# Altium project 光纤切割机电装图_E150_V2.PRJPCB
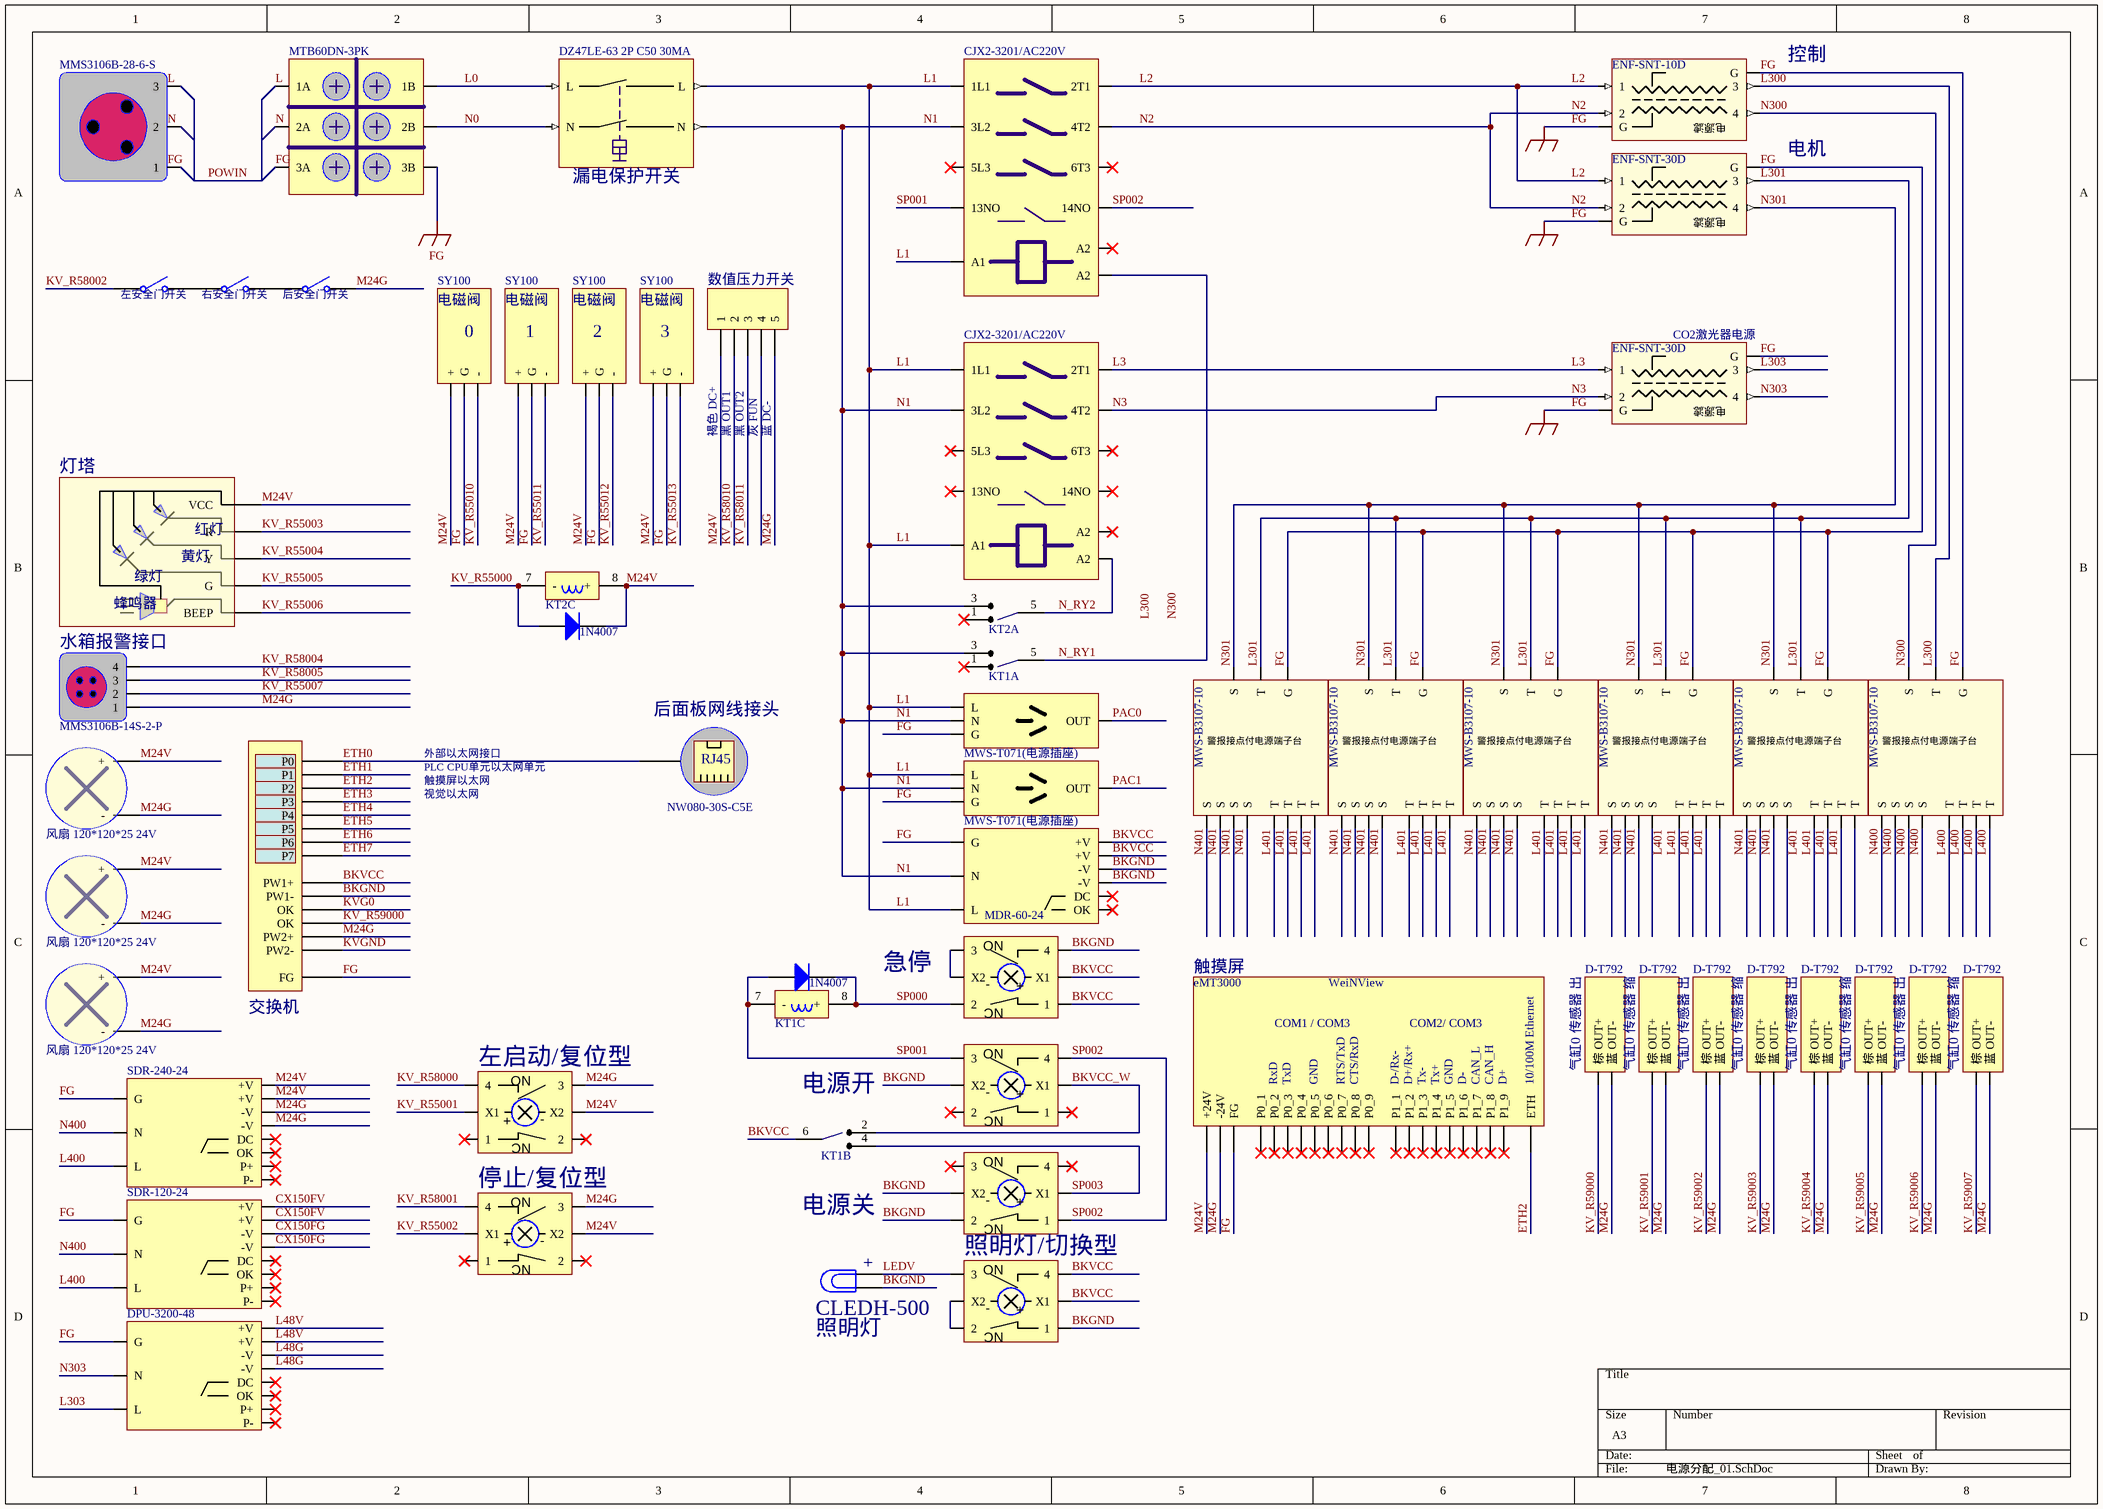
[diagram p0: 电源分配_01.SchDoc]
9 sheets, 125 parts. Net scope: global (net labels, ports and power ports of the same name join across sheets).
Sheets:
  电源分配_01.SchDoc
  KV7500_PLC.SchDoc
  KV2_MotionA12.SchDoc
  KV_Vision.SchDoc
  E150_Laser.SchDoc
  KV2_MotionA9A.SchDoc
  KV2_MotionA34.SchDoc
  KV2_MotionA56.SchDoc
  KV2_MotionA78.SchDoc

## Sheet 电源分配_01.SchDoc
size A3; PageSetup: Record=PageOptions|CenterHorizontal=True|CenterVertical=True|PrintScale=1.00|XCorrection=1.00|YCorrection=1.00|PrintKind=2|BorderSize=5000000|LeftOffset=0|BottomOffset=0|Orientation=2|PaperLength=1000|PaperWidth=1000|Scale=100|PaperSource=7|PrintQuality=-4|MediaType=1|DitherType=10|PaperKind=A3|PrintScaleMode=1

### Parts
(Parts that share a designator on the sheet are numbered #1, #2 ... from top to bottom, then left to right.)
*#1  DZ47LE-63 2P C50 30MA
*#2  ENF-SNT-10D
*#3  MMS3106B-28-6-S
*#4  MTB60DN-3PK
*#5  CJX2-3201/AC220V
*#6  ENF-SNT-30D
*#7  SY100
*#8  SY100
*#9  SY100
*#10  SY100
*#11  ENF-SNT-30D
*#12  CJX2-3201/AC220V
*#13  灯塔  (value not drawn)
*#14  MMS3106B-14S-2-P
*#15  MWS-T071(电源插座)
*#16  MWS-B3107-10
*#17  MWS-B3107-10
*#18  MWS-B3107-10
*#19  MWS-B3107-10
*#20  MWS-B3107-10
*#21  MWS-B3107-10
*#22  NW080-30S-C5E
*#23  风扇 120*120*25 24V
*#24  MWS-T071(电源插座)
*#25  SWITCH  (value not drawn)
*#26  MDR-60-24
*#27  风扇 120*120*25 24V
*#28  YMP22C-LMC2  (value not drawn)
*#29  风扇 120*120*25 24V
*#30  D-T792
*#31  D-T792
*#32  D-T792
*#33  D-T792
*#34  D-T792
*#35  D-T792
*#36  D-T792
*#37  D-T792
*#38  eMT3000
*#39  YMP22C-LMC2  (value not drawn)
*#40  YMP22C-LMC2  (value not drawn)
*#41  SDR-240-24
*#42  YMP22C-LMC2  (value not drawn)
*#43  YMP22C-LMC2  (value not drawn)
*#44  SDR-120-24
*#45  YMP22C-LMC2  (value not drawn)
*#46  DPU-3200-48
D?#1  1N4007  [DO-41]
D?#2  1N4007  [DO-41]
DS?  Lamp  [PIN2]  (value not drawn)
KT1  LY2N-J  (value not drawn)  (parts A,B,C of 3)
KT2  LY2N-J  (value not drawn)  (parts A,C of 3)
P?#1  Header 5  [HDR1X5]  (value not drawn)
S?#1  SW-SPST  [SPST-2]  (value not drawn)
S?#2  SW-SPST  [SPST-2]  (value not drawn)
S?#3  SW-SPST  [SPST-2]  (value not drawn)

### Nets
FG: *#2.1(G) *#4.2(3A) *#6.1(G) *#7.1(G) *#8.1(G) *#9.1(G) *#10.1(G) *#11.1(G) *#15.0(G) *#16.2(G) *#17.2(G) *#18.2(G) *#19.2(G) *#20.2(G) *#21.2(G) *#24.0(G) *#25.0(FG) *#26.6(G) *#38.174(FG) *#41.6(G) *#44.6(G) *#46.6(G)
L48G: *#46.2(-V) *#46.3(-V)
BKGND: *#25.0(PW1-) *#26.2(-V) *#26.3(-V) *#28.3(4) *#39.5(X2) *#42.1(2) *#42.5(X2) *#45.0(1) DS?.1
BKVCC: *#25.0(PW1+) *#26.0(+V) *#26.1(+V) *#28.0(1) *#28.4(X1) *#45.3(4) *#45.4(X1) KT1.6
BKVCC_W: *#39.4(X1) KT1.2
CX150FG: *#44.2(-V) *#44.3(-V)
CX150FV: *#44.0(+V) *#44.1(+V)
ETH0: *#22.0 *#25.3(P0)
ETH1: *#25.4(P1)
ETH2: *#25.5(P2) *#38.193(ETH)
ETH3: *#25.6(P3)
ETH4: *#25.3(P4)
ETH5: *#25.4(P5)
ETH6: *#25.5(P6)
ETH7: *#25.6(P7)
KV_R55000: D?#1.1(A) KT2.7(-)
KV_R55001: *#40.4(X1)
KV_R55002: *#43.4(X1)
KV_R55003: *#13.0(R)
KV_R55004: *#13.0(Y)
KV_R55005: *#13.0(G)
KV_R55006: *#13.0(BEEP)
KV_R55007: *#14.1(2)
KV_R55010: *#7.2(-)
KV_R55011: *#8.2(-)
KV_R55012: *#9.2(-)
KV_R55013: *#10.2(-)
KV_R58000: *#40.3(4)
KV_R58001: *#43.3(4)
KV_R58002: S?#1.1(COMMON)
KV_R58004: *#14.3(4)
KV_R58005: *#14.2(3)
KV_R58010: P?#1.2
KV_R58011: P?#1.3
KV_R59000: *#25.2(OK) *#30.1(棕_OUT+)
KV_R59001: *#31.1(棕_OUT+)
KV_R59002: *#32.1(棕_OUT+)
KV_R59003: *#33.1(棕_OUT+)
KV_R59004: *#34.1(棕_OUT+)
KV_R59005: *#35.1(棕_OUT+)
KV_R59006: *#36.1(棕_OUT+)
KV_R59007: *#37.1(棕_OUT+)
KVG0: *#25.1(OK)
KVGND: *#25.0(PW2-)
L: *#4.0(1A)
L0: *#1.1(L) *#4.0(1B)
L1: *#1.3(L) *#5.1L1 *#12.1L1 *#15.2(L) *#24.2(L) *#26.8(L)
L2: *#2.1 *#5.3(2T1) *#6.1
L3: *#11.1 *#12.3(13NO)
L48V: *#46.0(+V) *#46.1(+V)
L300: *#2.3 *#21.1(T)
L301: *#6.3 *#16.1(T) *#17.1(T) *#18.1(T) *#19.1(T) *#20.1(T)
L303: *#11.3 *#46.8(L)
L400: *#21.1(T) *#41.8(L) *#44.8(L)
L401: *#16.1(T) *#17.1(T) *#18.1(T) *#19.1(T) *#20.1(T)
LEDV: *#45.2(3) DS?.2
M24G: *#14.0(1) *#23.19(-) *#25.0(PW2+) *#27.19(-) *#29.19(-) *#30.2(蓝_OUT-) *#31.2(蓝_OUT-) *#32.2(蓝_OUT-) *#33.2(蓝_OUT-) *#34.2(蓝_OUT-) *#35.2(蓝_OUT-) *#36.2(蓝_OUT-) *#37.2(蓝_OUT-) *#38.173(-24V) *#40.2(3) *#41.2(-V) *#41.3(-V) *#43.2(3) P?#1.5 S?#3.2(NO)
M24V: *#7.0(+) *#8.0(+) *#9.0(+) *#10.0(+) *#13.1(VCC) *#23.20(+) *#27.20(+) *#29.20(+) *#38.172(+24V) *#40.5(X2) *#41.0(+V) *#41.1(+V) *#43.5(X2) D?#1.2(K) KT2.8(+) P?#1.1
N: *#4.1(2A)
N0: *#1.0(N) *#4.1(2B)
N1: *#1.2(N) *#5.3L2 *#12.3L2 *#15.1(N) *#24.1(N) *#26.7(N) KT1.3 KT2.3
N2: *#2.2 *#5.5L3 *#6.2
N3: *#11.2 *#12.5L3
N300: *#2.4 *#21.0(S)
N301: *#6.4 *#16.0(S) *#17.0(S) *#18.0(S) *#19.0(S) *#20.0(S)
N303: *#11.4 *#46.7(N)
N400: *#21.0(S) *#41.7(N) *#44.7(N)
N401: *#16.0(S) *#17.0(S) *#18.0(S) *#19.0(S) *#20.0(S)
N_RY1: *#5.1L1(A2) KT1.5
N_RY2: *#12.1L1(A2) KT2.5
PAC0: *#15.1(OUT)
PAC1: *#24.1(OUT)
SP000: *#28.1(2) D?#2.2(K) KT1.8(+)
SP001: *#5.3(13NO) *#39.2(3) D?#2.1(A) KT1.7(-)
SP002: *#5.1L1(14NO) *#39.3(4) *#42.0(1)
SP003: *#42.4(X1) KT1.4
Net*#28_2: *#28.2(3) *#28.5(X2)
Net*#45_1: *#45.1(2) *#45.5(X2)
NetS?#1_2: S?#1.2(NO) S?#2.1(COMMON)
NetS?#2_2: S?#2.2(NO) S?#3.1(COMMON)

Not connected (* = marked no-connect by the designer): *#3 0(1) 1(2) 2(3); *#26 4(DC)* 5(OK)*; *#38 175(P0_1)* 176(P0_2)* 177(P0_3)* 178(P0_4)* 179(P0_5)* 180(P0_6)* 181(P0_7)* 182(P0_8)* 183(P0_9)* 184(P1_1)* 185(P1_2)* 186(P1_3)* 187(P1_4)* 188(P1_5)* 189(P1_6)* 190(P1_7)* 191(P1_8)* 192(P1_9)*; *#39 0(1)* 1(2)*; *#40 0(1)* 1(2)*; *#41 4(DC)* 5(OK)*; *#42 2(3)* 3(4)*; *#43 0(1)* 1(2)*; *#44 4(DC)* 5(OK)*; *#46 4(DC)* 5(OK)*; KT1 1*; KT2 1*; P?#1 4

### Buses and harness runs
bus POWIN

### Notes on the sheet
- (near *#2) 控制
- (near *#1) 漏电保护开关
- (near *#6) 电机
- (near S?#1) 左安全门开关
- (near S?#2) 右安全门开关
- (near S?#3) 后安全门开关
- 电磁阀
- (near P?#1) 数值压力开关
- (near *#7) 0
- (near *#8) 1
- (near *#9) 2
- 3
- (near *#11) CO2激光器电源
- (near *#10) 褐色 DC+
- (near *#10) 黑 OUT1
- 黑 OUT2
- 灰 FUN
- 蓝 DC-
- 灯塔
- (near *#14) 水箱报警接口
- (near *#22) 后面板网线接头
- 外部以太网接口
- PLC CPU单元以太网单元
- 触摸屏以太网
- 视觉以太网
- 急停
- 触摸屏
- (near *#25) 交换机
- (near *#40) 左启动/复位型
- (near KT1) 电源开
- (near *#30) 气缸0 传感器 出
- (near *#30) 气缸0 传感器 缩
- (near *#31) 气缸0 传感器 出
- (near *#32) 气缸0 传感器 缩
- (near *#33) 气缸0 传感器 出
- (near *#34) 气缸0 传感器 缩
- (near *#35) 气缸0 传感器 出
- (near *#36) 气缸0 传感器 缩
- (near *#43) 停止/复位型
- 电源关
- (near *#42) 照明灯/切换型
- (near DS?) CLEDH-500
- (near DS?) +
- (near DS?) 照明灯
- Labels drawn without touching a wire or pin: FG, L, L300, L401, N, N300
- (in symbol eMT3000) WeiNView; COM1 / COM3; COM2/ COM3; RxD; TxD; GND; RTS/TxD; CTS/RxD; D-/Rx-; D+/Rx+; Tx-; Tx+; D-; CAN_L; CAN_H; D+; 10/100M Ethernet
- (in symbol ENF-SN) 电源滤
- (in symbol MWS-B3107-10) 警报接点付电源端子台
- (in symbol NW080-30S-C5E) RJ45
- (in symbol YMP22C) NO; -; +; NC
- (in symbol 灯塔) 红灯; 黄灯; 绿灯; 蜂鸣器

### Library data of the parts
*#1 = 空气开关(单相)
*#2 *#6 *#11 = ENF-SN
*#3 = MMS3106B-2
*#4 = MTB60D
*#5 *#12 = CJX2-3201/A
*#14 = EMSH-RST-C9-CA-5
*#23 *#27 *#29 = FAN
*#26 = MDR-60
*#28 *#39 *#40 *#42 *#43 *#45 = YMP22C
*#41 *#44 *#46 = SDR-480P
D?#1 D?#2 = Diode 1N4007: 1 Amp General Purpose Rectifier; Published: 8-Jun-2000; LatestRevisionDate: 17-Jul-2002; LatestRevisionNote: Re-released for DXP Platform.; DatasheetVersion: 1998; PackageVersion: Aug-1999; PackageReference: DO-41; Publisher: Altium Limited; PackageDescription: Diode, Axial; Body 5.2 x 2.7 mm (LxDia. max), Lead Dia. 0.86 mm (max); Code_JEDEC: DO-204-AL; ComponentLink1Description: Manufacturer Link; ComponentLink1URL: http://www.fairchildsemi.com/; ComponentLink2Description: Datasheet; ComponentLink2URL: http://www.fairchildsemi.com/ds/1N%2F1N4001.pdf
DS? = Lamp: Incandescent Bulb; Published: 24-Mar-1999; LatestRevisionDate: 17-Jul-2002; LatestRevisionNote: Re-released for DXP Platform.; PackageReference: PIN2; Publisher: Altium Limited
KT1 KT2 = L
P?#1 = Header 5: Header, 5-Pin; LatestRevisionDate: 17-Jul-2002; LatestRevisionNote: Re-released for DXP Platform.; Publisher: Altium Limited
S?#1-S?#3 = SW-SPST: Single-Pole, Single-Throw Switch; Published: 24-Mar-1999; LatestRevisionDate: 17-Jul-2002; LatestRevisionNote: Re-released for DXP Platform.; PackageReference: SPST-2; Publisher: Altium Limited

## Sheet KV7500_PLC.SchDoc
size A3; PageSetup: Record=PageOptions|CenterHorizontal=True|CenterVertical=True|PrintScale=1.00|XCorrection=1.00|YCorrection=1.00|PrintKind=2|BorderSize=5000000|LeftOffset=0|BottomOffset=0|Orientation=2|PaperLength=1000|PaperWidth=1000|Scale=100|PaperSource=7|PrintQuality=-4|MediaType=1|DitherType=10|PaperKind=A3|PrintScaleMode=1
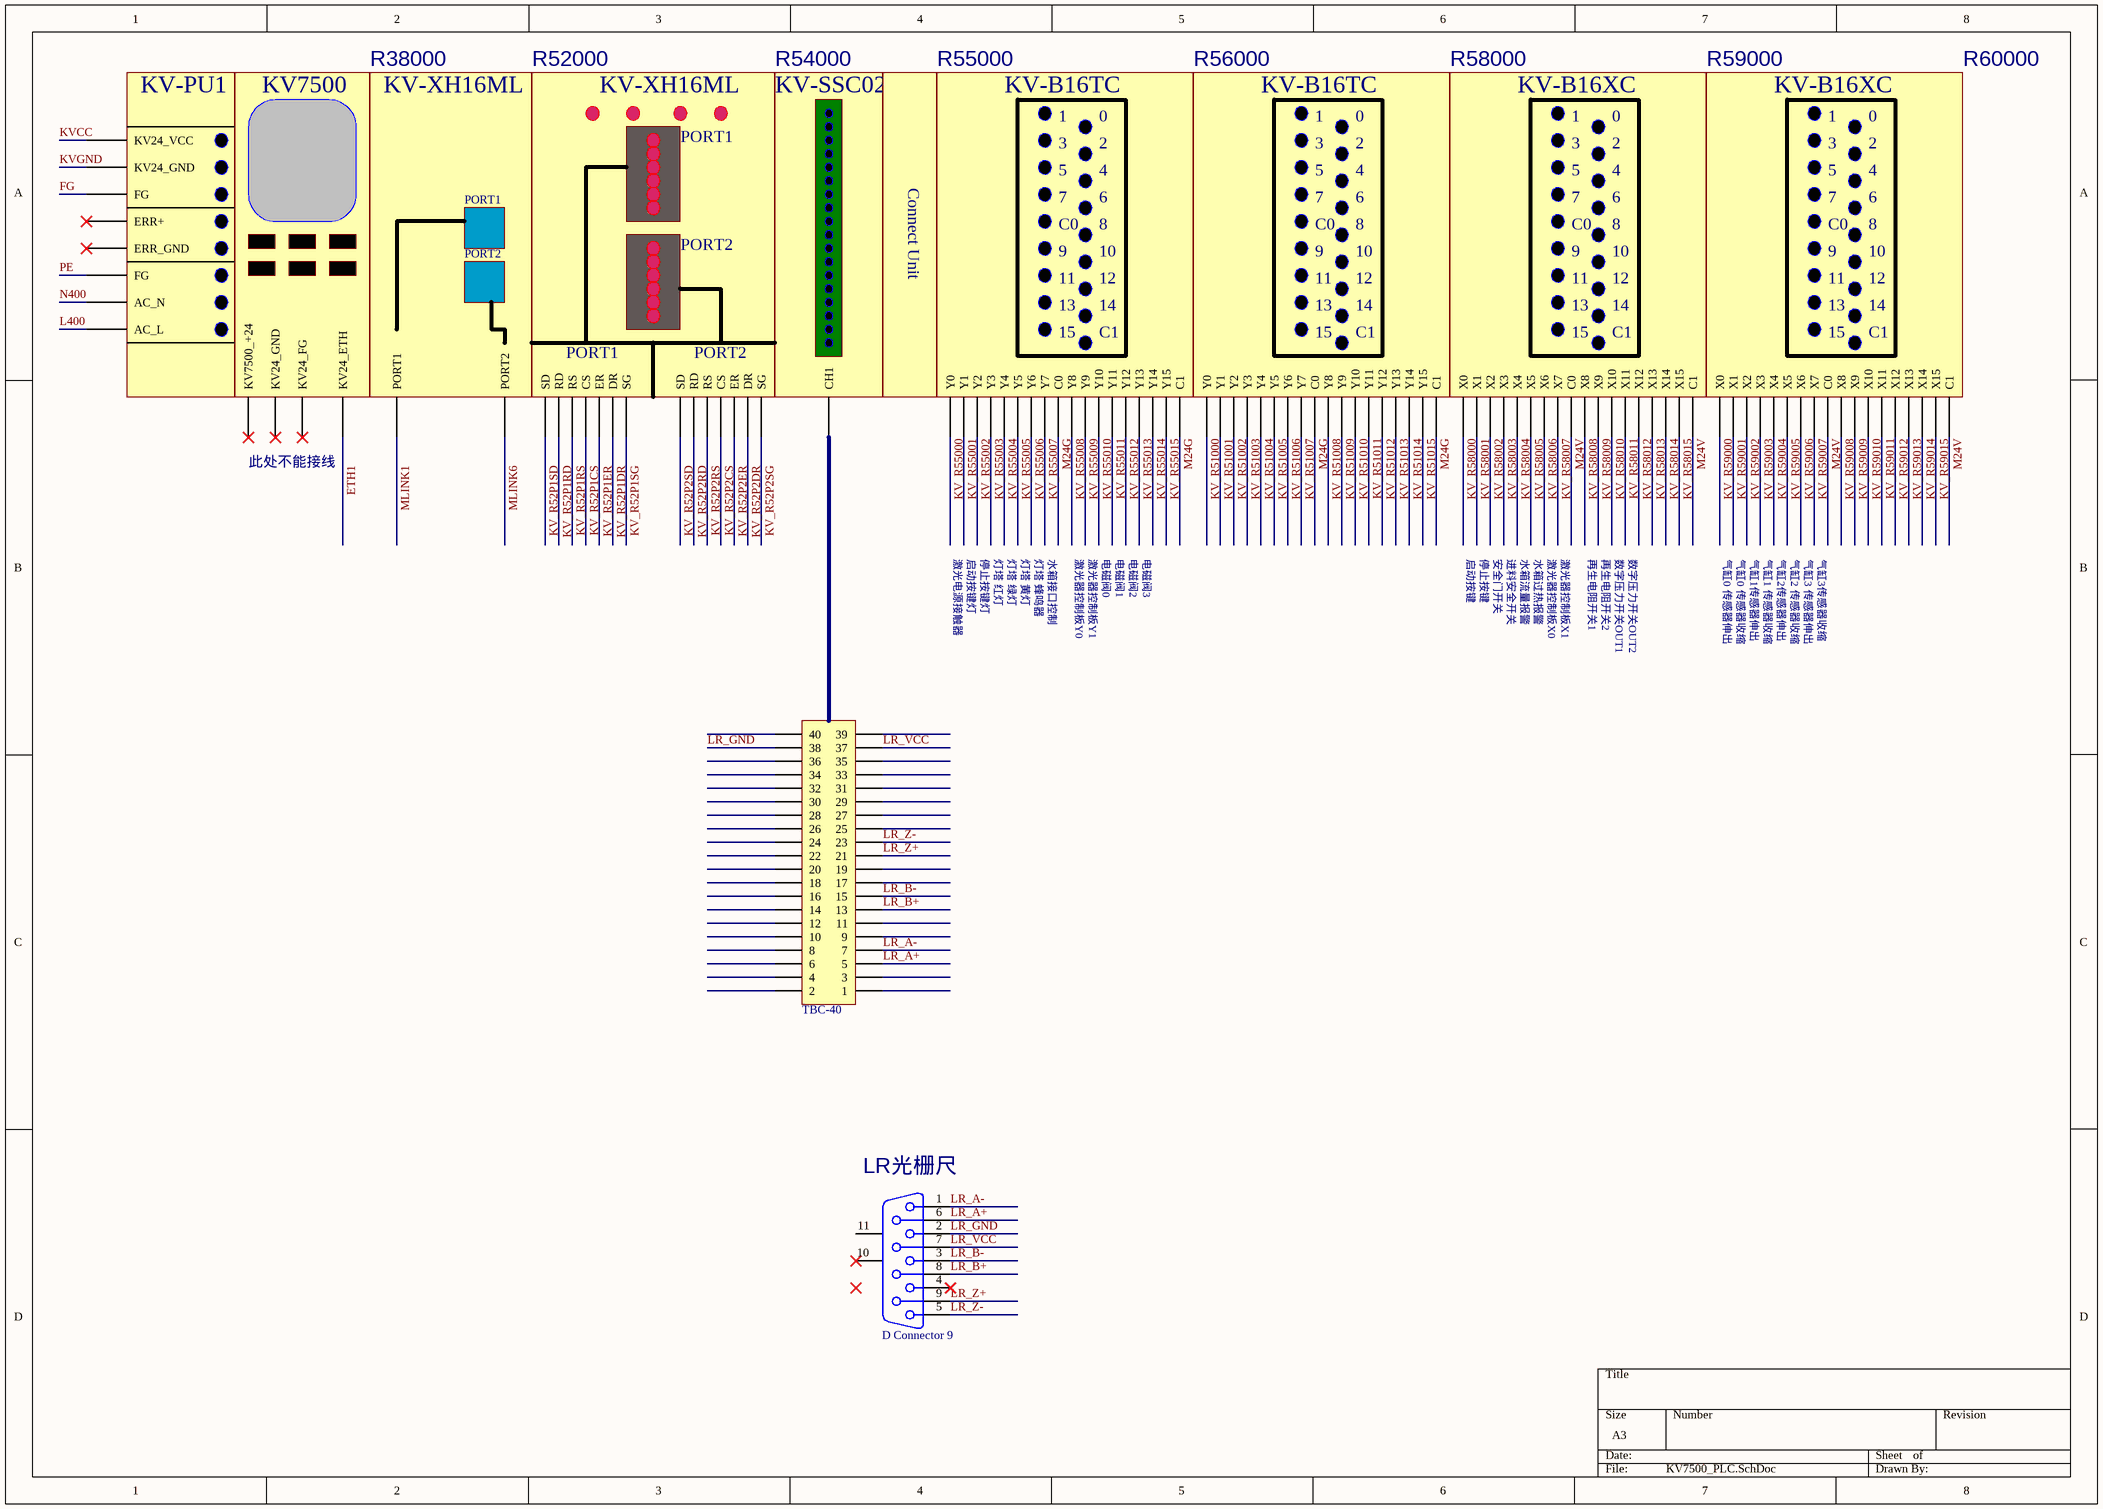
[diagram p1: KV7500_PLC.SchDoc]

### Parts
(Parts that share a designator on the sheet are numbered #1, #2 ... from top to bottom, then left to right.)
*#47  KV-PU1  (value not drawn)
*#48  KV7500  (value not drawn)
*#49  KV-XH16ML  (value not drawn)
*#50  KV-XL202  (value not drawn)
*#51  KV-SSC02  (value not drawn)
*#52  KV-CU  (value not drawn)
*#53  KV-B16TC  (value not drawn)
*#54  KV-B16TC  (value not drawn)
*#55  KV-B16XC  (value not drawn)
*#56  KV-B16XC  (value not drawn)
J?#1  D Connector 9  [DSUB1.385-2H9]
P?#2  TBC-40  [HDR2X20]

### Nets
FG: *#47.196(FG)
PE: *#47.196(FG)  [project net L48G]
ETH1: *#48.201(KV7500_+24)
KV_R52P1CS: *#50.208(CS)
KV_R52P1DR: *#50.210(DR)
KV_R52P1ER: *#50.209(ER)
KV_R52P1RD: *#50.206(RD)
KV_R52P1RS: *#50.207(RS)
KV_R52P1SD: *#50.205(SD)
KV_R52P1SG: *#50.211(SG)
KV_R52P2CS: *#50.208(CS)
KV_R52P2DR: *#50.210(DR)
KV_R52P2ER: *#50.209(ER)
KV_R52P2RD: *#50.206(RD)
KV_R52P2RS: *#50.207(RS)
KV_R52P2SD: *#50.205(SD)
KV_R52P2SG: *#50.211(SG)
KV_R51000: *#54.X18(Y0)
KV_R51001: *#54.X19(Y1)
KV_R51002: *#54.X20(Y2)
KV_R51003: *#54.X21(Y3)
KV_R51004: *#54.X22(Y4)
KV_R51005: *#54.X23(Y5)
KV_R51006: *#54.X24(Y6)
KV_R51007: *#54.X25(Y7)
KV_R51008: *#54.X26(Y8)
KV_R51009: *#54.X27(Y9)
KV_R51010: *#54.X28(Y10)
KV_R51011: *#54.X29(Y11)
KV_R51012: *#54.X30(Y12)
KV_R51013: *#54.X31(Y13)
KV_R51014: *#54.X32(Y14)
KV_R51015: *#54.X33(Y15)
KV_R55000: *#53.X18(Y0)
KV_R55001: *#53.X19(Y1)
KV_R55002: *#53.X20(Y2)
KV_R55003: *#53.X21(Y3)
KV_R55004: *#53.X22(Y4)
KV_R55005: *#53.X23(Y5)
KV_R55006: *#53.X24(Y6)
KV_R55007: *#53.X25(Y7)
KV_R55008: *#53.X26(Y8)
KV_R55009: *#53.X27(Y9)
KV_R55010: *#53.X28(Y10)
KV_R55011: *#53.X29(Y11)
KV_R55012: *#53.X30(Y12)
KV_R55013: *#53.X31(Y13)
KV_R55014: *#53.X32(Y14)
KV_R55015: *#53.X33(Y15)
KV_R58000: *#55.X0
KV_R58001: *#55.X1
KV_R58002: *#55.X2
KV_R58003: *#55.X3
KV_R58004: *#55.X4
KV_R58005: *#55.X5
KV_R58006: *#55.X6
KV_R58007: *#55.X7
KV_R58008: *#55.X9(X8)
KV_R58009: *#55.X10(X9)
KV_R58010: *#55.X11(X10)
KV_R58011: *#55.X12(X11)
KV_R58012: *#55.X13(X12)
KV_R58013: *#55.X14(X13)
KV_R58014: *#55.X15(X14)
KV_R58015: *#55.X16(X15)
KV_R59000: *#56.X0
KV_R59001: *#56.X1
KV_R59002: *#56.X2
KV_R59003: *#56.X3
KV_R59004: *#56.X4
KV_R59005: *#56.X5
KV_R59006: *#56.X6
KV_R59007: *#56.X7
KV_R59008: *#56.X9(X8)
KV_R59009: *#56.X10(X9)
KV_R59010: *#56.X11(X10)
KV_R59011: *#56.X12(X11)
KV_R59012: *#56.X13(X12)
KV_R59013: *#56.X14(X13)
KV_R59014: *#56.X15(X14)
KV_R59015: *#56.X16(X15)
KVCC: *#47.200(KV24_VCC)
KVGND: *#47.199(KV24_GND)
L400: *#47.194(AC_L)
LR_A+: J?#1.6 P?#2.5
LR_A-: J?#1.1 P?#2.7
LR_B+: J?#1.8 P?#2.13
LR_B-: J?#1.3 P?#2.15
LR_GND: J?#1.2 P?#2.38
LR_VCC: J?#1.7 P?#2.37
LR_Z+: J?#1.9 P?#2.21
LR_Z-: J?#1.5 P?#2.23
M24G: *#53.X8(C0) *#53.X17(C1) *#54.X8(C0) *#54.X17(C1)
M24V: *#55.X8(C0) *#55.X17(C1) *#56.X8(C0) *#56.X17(C1)
MLINK1: *#49.203(PORT1)
MLINK6: *#49.202(PORT2)
N400: *#47.195(AC_N)

Not connected (* = marked no-connect by the designer): *#47 197(ERR+)* 198(ERR_GND)*; *#51 204(CH1); J?#1 4* 10(MH1)* 11(MH2); P?#2 1 2 3 4 6 8 9 10 11 12 14 16 17 18 19 20 22 24 25 26 27 28 29 30 31 32 33 34 35 36 39 40

### Notes on the sheet
- R38000
- R52000
- R54000
- R55000
- R56000
- R58000
- R59000
- R60000
- 此处不能接线
- 激光电源接触器
- 启动按键灯
- 停止按键灯
- 灯塔 红灯
- 灯塔 绿灯
- 灯塔 黄灯
- 灯塔 蜂鸣器
- 水箱接口控制
- 激光器控制板Y0
- 激光器控制板Y1
- 电磁阀0
- 电磁阀1
- 电磁阀2
- 电磁阀3
- 启动按键
- 停止按键
- 安全门开关
- 进料安全开关
- 水箱流量报警
- 水箱过热报警
- 激光器控制板X0
- 激光器控制板X1
- 再生电阻开关1
- 再生电阻开关2
- 数字压力开关OUT1
- 数字压力开关OUT2
- 气缸0 传感器伸出
- 气缸0 传感器收缩
- 气缸1传感器伸出
- 气缸1 传感器收缩
- 气缸2传感器伸出
- 气缸2 传感器收缩
- 气缸3 传感器伸出
- 气缸3传感器收缩
- (near J?#1) LR光栅尺
- (in symbol KV-B16TC) 1; 0; 3; 2; 5; 4; 7; 6; 8; 9; 10; 11; 12; 13; 14; 15
- (in symbol KV-B16XC) 1; 0; 3; 2; 5; 4; 7; 6; 8; 9; 10; 11; 12; 13; 14; 15
- (in symbol KV-CU) Connect Unit
- (in symbol KV-XL202) KV-XH16ML; PORT1; PORT2

### Library data of the parts
J?#1 = D Connector 9: Receptacle Assembly, 9 Position, Right Angle; PackageDocument: O; Positions: 9; Published: 15-Jun-2001; LatestRevisionDate: 17-Jul-2002; LatestRevisionNote: Re-released for DXP Platform.; DatasheetDocument: 1-Sep-1999; PackageReference: 788750; Publisher: Altium Limited; Orientation: Right Angle; Gender: Receptacle
P?#2 = Header 20X2: Header, 20-Pin, Dual row; LatestRevisionDate: 17-Jul-2002; LatestRevisionNote: Re-released for DXP Platform.; Publisher: Altium Limited

## Sheet KV2_MotionA12.SchDoc
size A3; PageSetup: Record=PageOptions|CenterHorizontal=True|CenterVertical=True|PrintScale=1.00|XCorrection=1.00|YCorrection=1.00|PrintKind=2|BorderSize=5000000|LeftOffset=0|BottomOffset=0|Orientation=2|PaperLength=1000|PaperWidth=1000|Scale=100|PaperSource=7|PrintQuality=-4|MediaType=1|DitherType=10|PaperKind=A3|PrintScaleMode=1
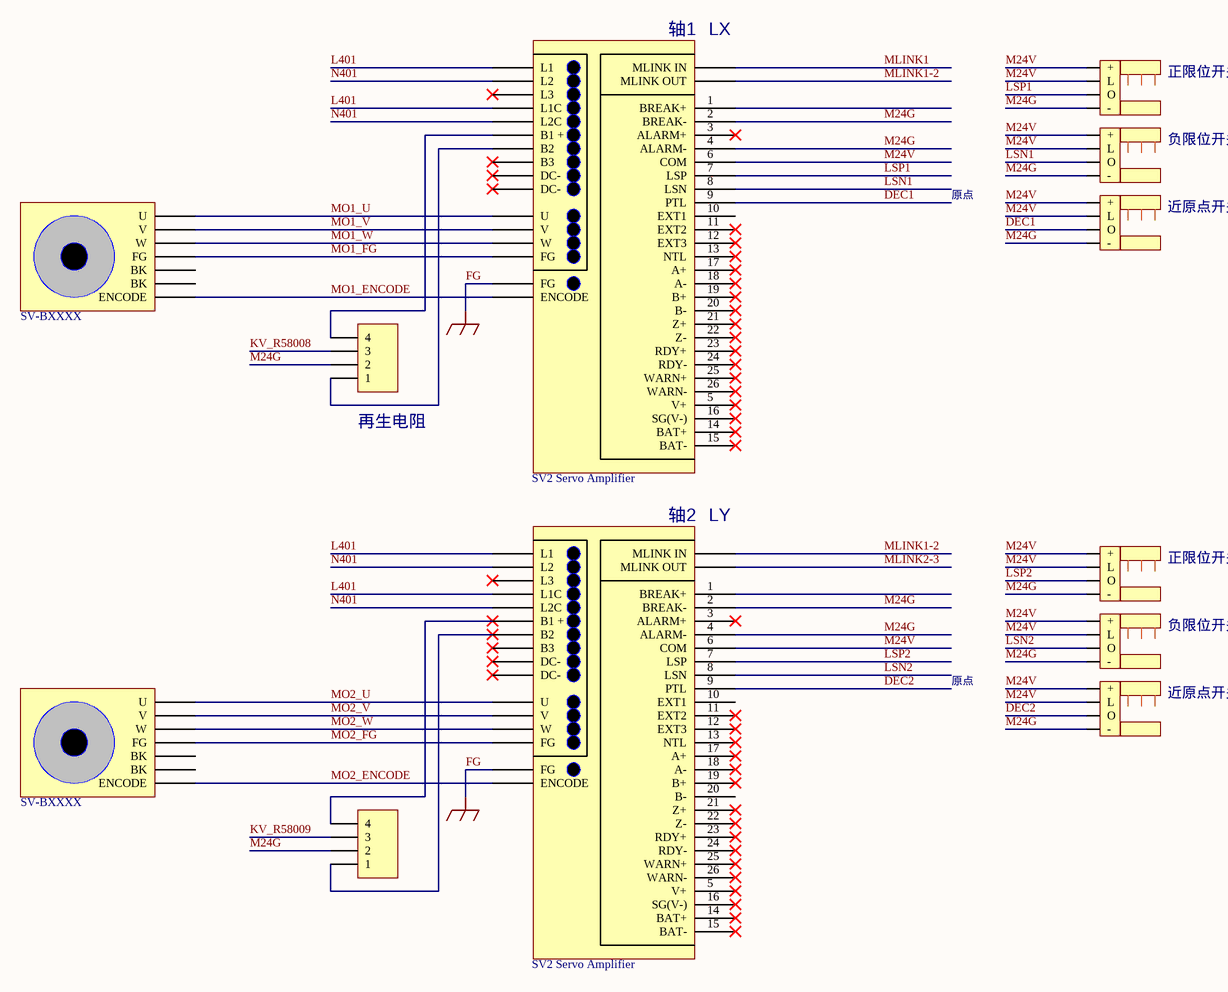
[diagram p2: KV2_MotionA12.SchDoc]

### Parts
(Parts that share a designator on the sheet are numbered #1, #2 ... from top to bottom, then left to right.)
*#57  SV2 Servo Amplifier
*#58  SV-BXXXX
*#59  SV2 Servo Amplifier
*#60  SV-BXXXX
P?#3  Header 4  [HDR1X4]  (value not drawn)
P?#4  Header 4  [HDR1X4]  (value not drawn)
原点光纤传感器#1  OMRON  E3X-HD  (value not drawn)
原点光纤传感器#2  OMRON  E3X-HD  (value not drawn)
原点光纤传感器#3  OMRON  E3X-HD  (value not drawn)
原点光纤传感器#4  OMRON  E3X-HD  (value not drawn)
原点光纤传感器#5  OMRON  E3X-HD  (value not drawn)
原点光纤传感器#6  OMRON  E3X-HD  (value not drawn)

### Nets
FG: *#57.X43(FG) *#59.X43(FG)  [also labelled GND]
DEC1: *#57.9(PTL) 原点光纤传感器#3.91(O)
DEC2: *#59.9(PTL) 原点光纤传感器#6.91(O)
KV_R58008: P?#3.3
KV_R58009: P?#4.3
L401: *#57.X34(L1) *#57.X37(L1C) *#59.X34(L1) *#59.X37(L1C)
LSN1: *#57.8(LSN) 原点光纤传感器#2.91(O)
LSN2: *#59.8(LSN) 原点光纤传感器#5.91(O)
LSP1: *#57.7(LSP) 原点光纤传感器#1.91(O)
LSP2: *#59.7(LSP) 原点光纤传感器#4.91(O)
M24G: *#57.2(BREAK-) *#57.4(ALARM-) *#59.2(BREAK-) *#59.4(ALARM-) P?#3.2 P?#4.2 原点光纤传感器#1.92(-) 原点光纤传感器#2.92(-) 原点光纤传感器#3.92(-) 原点光纤传感器#4.92(-) 原点光纤传感器#5.92(-) 原点光纤传感器#6.92(-)
M24V: *#57.6(COM) *#59.6(COM) 原点光纤传感器#1.89(+) 原点光纤传感器#1.90(L) 原点光纤传感器#2.89(+) 原点光纤传感器#2.90(L) 原点光纤传感器#3.89(+) 原点光纤传感器#3.90(L) 原点光纤传感器#4.89(+) 原点光纤传感器#4.90(L) 原点光纤传感器#5.89(+) 原点光纤传感器#5.90(L) 原点光纤传感器#6.89(+) 原点光纤传感器#6.90(L)
MLINK1: *#57.X44(MLINK_IN)
MLINK1-2: *#57.X44(MLINK_OUT) *#59.X44(MLINK_IN)
MLINK2-3: *#59.X44(MLINK_OUT)
MO1_ENCODE: *#57.X44(ENCODE) *#58.29(ENCODE)
MO1_FG: *#57.X43(FG) *#58.29(FG)
MO1_U: *#57.X43(DC-) *#58.27(U)
MO1_V: *#57.X43(V) *#58.28(V)
MO1_W: *#57.X43(W) *#58.29(W)
MO2_ENCODE: *#59.X44(ENCODE) *#60.29(ENCODE)
MO2_FG: *#59.X43(FG) *#60.29(FG)
MO2_U: *#59.X43(DC-) *#60.27(U)
MO2_V: *#59.X43(V) *#60.28(V)
MO2_W: *#59.X43(W) *#60.29(W)
N401: *#57.X35(L2) *#57.X38(L2C) *#59.X35(L2) *#59.X38(L2C)
Net*#57_X39: *#57.X39(B1_+) P?#3.4
Net*#57_X40: *#57.X40(B2) P?#3.1
Net*#59_X39: *#59.X39(B1_+) P?#4.4
Net*#59_X40: *#59.X40(B2) P?#4.1

Not connected (* = marked no-connect by the designer): *#57 1(BREAK+) 3(ALARM+)* 5(V+)* 10(EXT1) 11(EXT2)* 12(EXT3)* 13(NTL)* 14(BAT+)* 15(BAT-)* 16(SG(V-))* 17(A+)* 18(A-)* 19(B+)* 20(B-)* 21(Z+)* 22(Z-)* 23(RDY+)* 24(RDY-)* 25(WARN+)* 26(WARN-)* X36(L3)* X41(B3)* X42(DC-)*; *#58 30(BK) 31(BK); *#59 1(BREAK+) 3(ALARM+)* 5(V+)* 10(EXT1) 11(EXT2)* 12(EXT3)* 13(NTL)* 14(BAT+)* 15(BAT-)* 16(SG(V-))* 17(A+)* 18(A-)* 19(B+)* 20(B-) 21(Z+)* 22(Z-)* 23(RDY+)* 24(RDY-)* 25(WARN+)* 26(WARN-)* X36(L3)* X41(B3)* X42(DC-)*; *#60 30(BK) 31(BK)

### Notes on the sheet
- (near *#57) 轴1
- (near *#57) LX
- 正限位开关
- 负限位开关
- 原点
- 近原点开关
- (near P?#3) 再生电阻
- (near *#59) 轴2
- (near *#59) LY

### Library data of the parts
P?#3 P?#4 = Header 4: Header, 4-Pin; LatestRevisionDate: 17-Jul-2002; LatestRevisionNote: Re-released for DXP Platform.; Publisher: Altium Limited
原点光纤传感器#1-原点光纤传感器#6 = OMRON_EE-SX671

## Sheet KV_Vision.SchDoc
size A3; PageSetup: Record=PageOptions|CenterHorizontal=True|CenterVertical=True|PrintScale=1.00|XCorrection=1.00|YCorrection=1.00|PrintKind=2|BorderSize=5000000|LeftOffset=0|BottomOffset=0|Orientation=2|PaperLength=1000|PaperWidth=1000|Scale=100|PaperSource=7|PrintQuality=-4|MediaType=1|DitherType=10|PaperKind=A3|PrintScaleMode=1
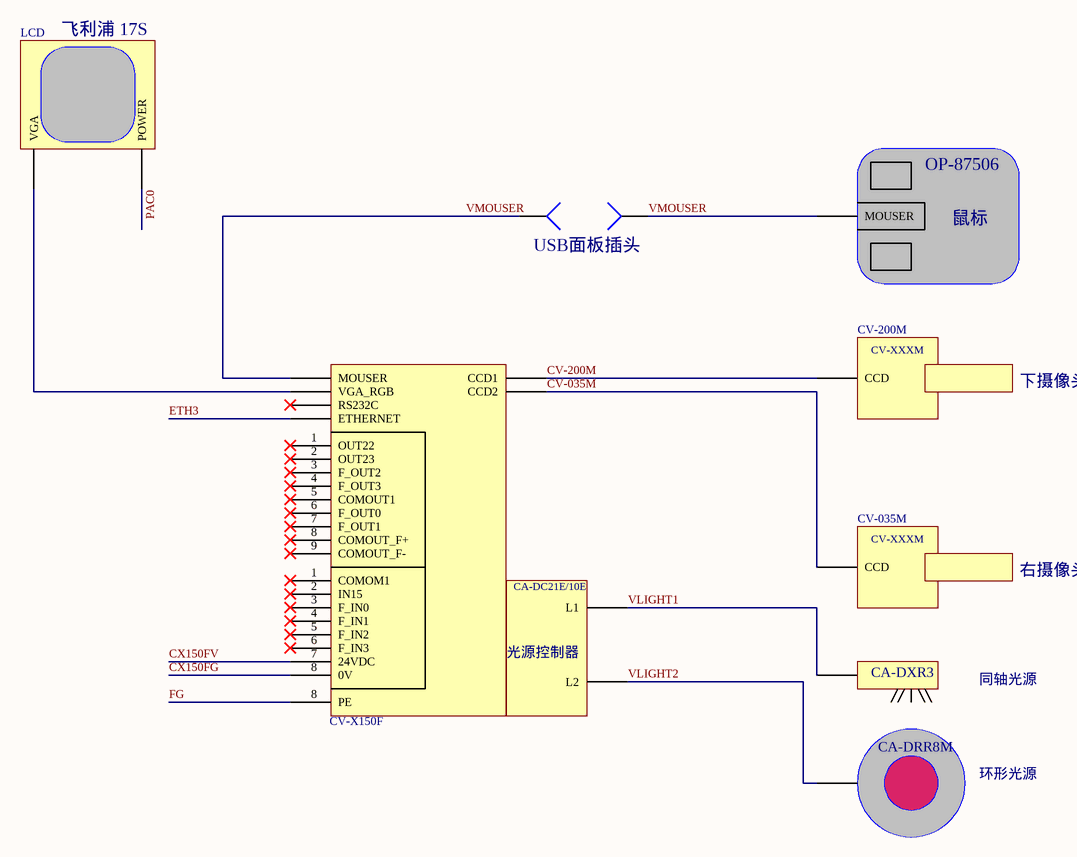
[diagram p3: KV_Vision.SchDoc]

### Parts
(Parts that share a designator on the sheet are numbered #1, #2 ... from top to bottom, then left to right.)
*#61  LCD
*#62  MOUSER  (value not drawn)
*#63  CV-200M
*#64  CV-X150F
*#65  CV-035M
*#66  CA-DC21E/10E  (value not drawn)
*#67  CA-DXR3  (value not drawn)
*#68  CA-DRR8M  (value not drawn)
J?#2  Socket  [PIN1]  (value not drawn)
J?#3  Socket  [PIN1]  (value not drawn)

### Nets
FG: *#64.8(PE)
CV-035M: *#64.11(CCD2) *#65.0(CCD)
CV-200M: *#63.0(CCD) *#64.10(CCD1)
CX150FG: *#64.8(COMOUT_F+)
CX150FV: *#64.7(F_OUT1)
ETH3: *#64.?3(ETHERNET)
PAC0: *#61.1(POWER)
VLIGHT1: *#66.0(L1) *#67.0
VLIGHT2: *#66.1(L2) *#68.0
VMOUSER: *#62.0(MOUSER) *#64.?4(MOUSER) J?#2.1 J?#3.1
Net*#61_0: *#61.0(VGA) *#64.?1(VGA_RGB)

Not connected (* = marked no-connect by the designer): *#64 1(OUT22)* 2(OUT23)* 3(F_OUT2)* 4(F_OUT3)* 5(COMOUT1)* 6(F_OUT0)* 9(COMOUT_F-)* ?2(RS232C)*

### Notes on the sheet
- 飞利浦 17S
- OP-87506
- (near J?#3) USB面板插头
- 鼠标
- 下摄像头
- 右摄像头
- (near *#64) 光源控制器
- 同轴光源
- 环形光源
- (in symbol CV-200M) CV-XXXM

### Library data of the parts
*#65 = CV-200M
J?#2 J?#3 = Socket: LatestRevisionDate: 17-Jul-2002; LatestRevisionNote: Re-released for DXP Platform.; Publisher: Altium Limited

## Sheet E150_Laser.SchDoc
size A3; PageSetup: Record=PageOptions|CenterHorizontal=True|CenterVertical=True|PrintScale=1.00|XCorrection=1.00|YCorrection=1.00|PrintKind=2|BorderSize=5000000|LeftOffset=0|BottomOffset=0|Orientation=2|PaperLength=1000|PaperWidth=1000|Scale=100|PaperSource=7|PrintQuality=-4|MediaType=1|DitherType=10|PaperKind=A3|PrintScaleMode=1
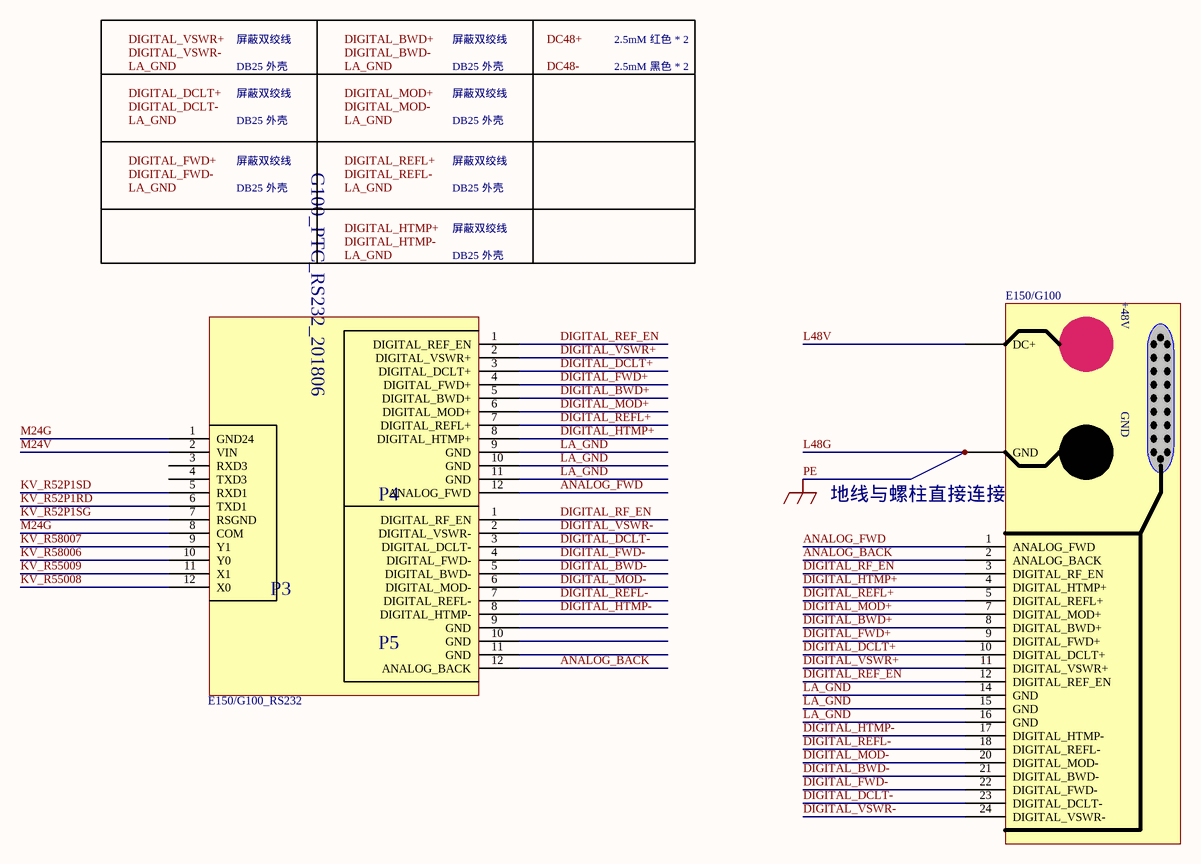
[diagram p4: E150_Laser.SchDoc]

### Parts
(Parts that share a designator on the sheet are numbered #1, #2 ... from top to bottom, then left to right.)
*#69  E150/G100
*#70  E150/G100_RS232

### Nets
L48G: *#69.1(GND)  [also labelled PE]
ANALOG_BACK: *#69.2(ANALOG_BACK) *#70.12(ANALOG_BACK)
ANALOG_FWD: *#69.1(ANALOG_FWD) *#70.12(ANALOG_FWD)
DIGITAL_BWD+: *#69.8(DIGITAL_BWD+) *#70.5(DIGITAL_BWD+)
DIGITAL_BWD-: *#69.21(DIGITAL_BWD-) *#70.5(DIGITAL_BWD-)
DIGITAL_DCLT+: *#69.10(DIGITAL_DCLT+) *#70.3(RXD3)
DIGITAL_DCLT-: *#69.23(DIGITAL_DCLT-) *#70.3(DIGITAL_DCLT-)
DIGITAL_FWD+: *#69.9(DIGITAL_FWD+) *#70.4(TXD3)
DIGITAL_FWD-: *#69.22(DIGITAL_FWD-) *#70.4(DIGITAL_FWD-)
DIGITAL_HTMP+: *#69.4(DIGITAL_HTMP+) *#70.8(DIGITAL_HTMP+)
DIGITAL_HTMP-: *#69.17(DIGITAL_HTMP-) *#70.8(DIGITAL_HTMP-)
DIGITAL_MOD+: *#69.7(DIGITAL_MOD+) *#70.6(DIGITAL_MOD+)
DIGITAL_MOD-: *#69.20(DIGITAL_MOD-) *#70.6(DIGITAL_MOD-)
DIGITAL_REF_EN: *#69.12(DIGITAL_REF_EN) *#70.1(DIGITAL_REF_EN)
DIGITAL_REFL+: *#69.5(DIGITAL_REFL+) *#70.7(DIGITAL_REFL+)
DIGITAL_REFL-: *#69.18(DIGITAL_REFL-) *#70.7(DIGITAL_REFL-)
DIGITAL_RF_EN: *#69.3(DIGITAL_RF_EN) *#70.1(DIGITAL_RF_EN)
DIGITAL_VSWR+: *#69.11(DIGITAL_VSWR+) *#70.2(DIGITAL_VSWR+)
DIGITAL_VSWR-: *#69.24(DIGITAL_VSWR-) *#70.2(DIGITAL_VSWR-)
KV_R52P1RD: *#70.6(TXD1)
KV_R52P1SD: *#70.5(RXD1)
KV_R52P1SG: *#70.7(RSGND)
KV_R55008: *#70.12(X0)
KV_R55009: *#70.11(X1)
KV_R58006: *#70.10(Y0)
KV_R58007: *#70.9(Y1)
L48V: *#69.0(DC+)
LA_GND: *#69.14(GND) *#69.15(GND) *#69.16(GND) *#70.9(GND) *#70.10(GND) *#70.11(GND)
M24G: *#70.1(GND24) *#70.8(COM)
M24V: *#70.2(VIN)

### Notes on the sheet
- 屏蔽双绞线
- 2.5mM 红色 * 2
- DB25 外壳
- 2.5mM 黑色 * 2
- 地线与螺柱直接连接
- Labels drawn without touching a wire or pin: DC48+, DC48-, DIGITAL_BWD+, DIGITAL_BWD-, DIGITAL_DCLT+, DIGITAL_DCLT-, DIGITAL_FWD+, DIGITAL_FWD-, DIGITAL_HTMP+, DIGITAL_HTMP-, DIGITAL_MOD+, DIGITAL_MOD-, DIGITAL_REFL+, DIGITAL_REFL-, DIGITAL_VSWR+, DIGITAL_VSWR-, LA_GND
- (in symbol E150/G100) +48V
- (in symbol E150/G100_RS232) G100_PTC_RS232_201806; P4; P3; P5

## Sheet KV2_MotionA9A.SchDoc
size A3; PageSetup: Record=PageOptions|CenterHorizontal=True|CenterVertical=True|PrintScale=1.00|XCorrection=1.00|YCorrection=1.00|PrintKind=2|BorderSize=5000000|LeftOffset=0|BottomOffset=0|Orientation=2|PaperLength=1000|PaperWidth=1000|Scale=100|PaperSource=7|PrintQuality=-4|MediaType=1|DitherType=10|PaperKind=A3|PrintScaleMode=1
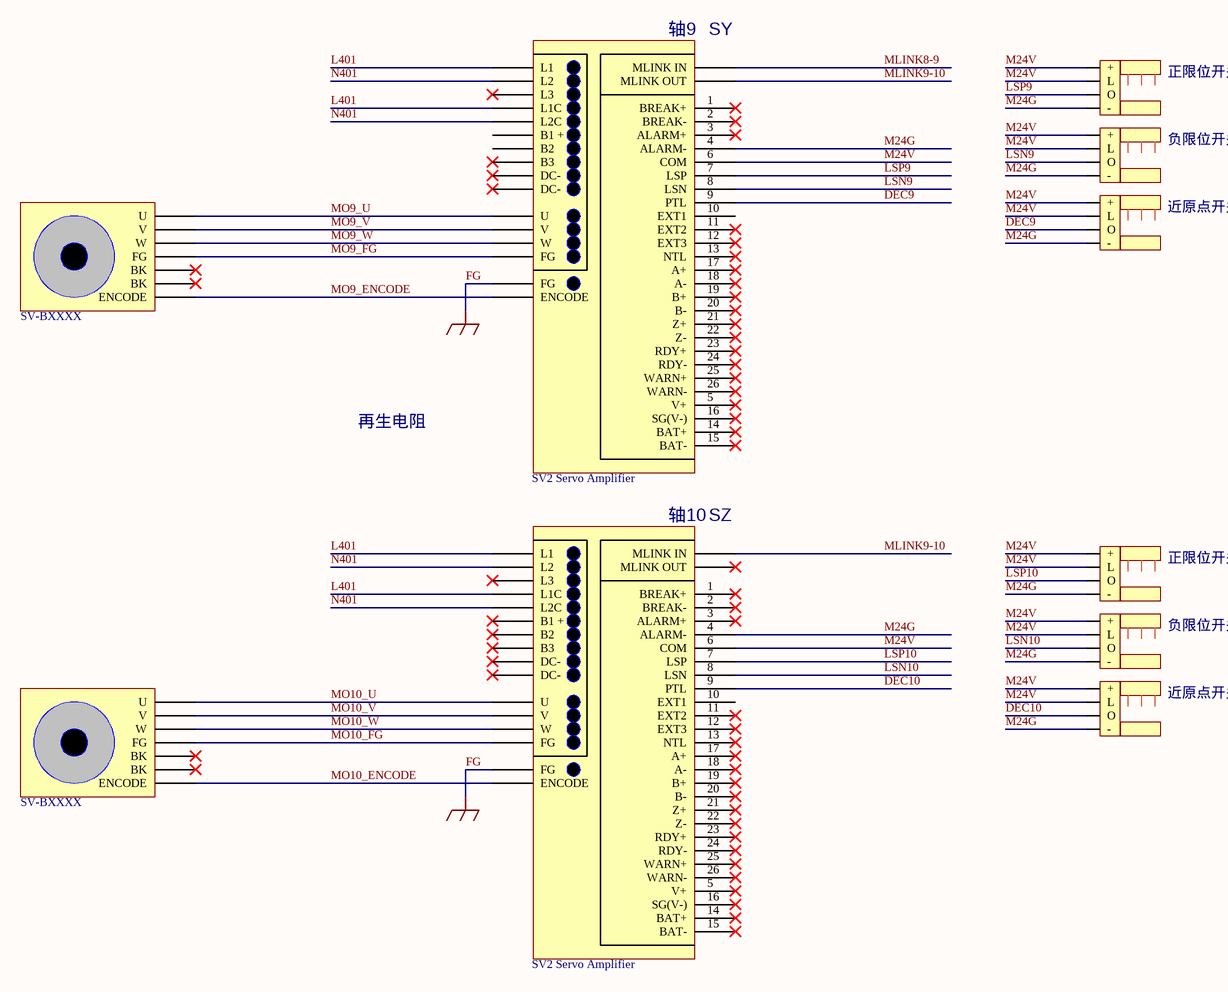
[diagram p5: KV2_MotionA9A.SchDoc]

### Parts
(Parts that share a designator on the sheet are numbered #1, #2 ... from top to bottom, then left to right.)
*#71  SV2 Servo Amplifier
*#72  SV-BXXXX
*#73  SV2 Servo Amplifier
*#74  SV-BXXXX
原点光纤传感器#7  OMRON  E3X-HD  (value not drawn)
原点光纤传感器#8  OMRON  E3X-HD  (value not drawn)
原点光纤传感器#9  OMRON  E3X-HD  (value not drawn)
原点光纤传感器#10  OMRON  E3X-HD  (value not drawn)
原点光纤传感器#11  OMRON  E3X-HD  (value not drawn)
原点光纤传感器#12  OMRON  E3X-HD  (value not drawn)

### Nets
FG: *#71.X43(FG) *#73.X43(FG)  [also labelled GND]
DEC9: *#71.9(PTL) 原点光纤传感器#9.91(O)
DEC10: *#73.9(PTL) 原点光纤传感器#12.91(O)
L401: *#71.X34(L1) *#71.X37(L1C) *#73.X34(L1) *#73.X37(L1C)
LSN9: *#71.8(LSN) 原点光纤传感器#8.91(O)
LSN10: *#73.8(LSN) 原点光纤传感器#11.91(O)
LSP9: *#71.7(LSP) 原点光纤传感器#7.91(O)
LSP10: *#73.7(LSP) 原点光纤传感器#10.91(O)
M24G: *#71.4(ALARM-) *#73.4(ALARM-) 原点光纤传感器#7.92(-) 原点光纤传感器#8.92(-) 原点光纤传感器#9.92(-) 原点光纤传感器#10.92(-) 原点光纤传感器#11.92(-) 原点光纤传感器#12.92(-)
M24V: *#71.6(COM) *#73.6(COM) 原点光纤传感器#7.89(+) 原点光纤传感器#7.90(L) 原点光纤传感器#8.89(+) 原点光纤传感器#8.90(L) 原点光纤传感器#9.89(+) 原点光纤传感器#9.90(L) 原点光纤传感器#10.89(+) 原点光纤传感器#10.90(L) 原点光纤传感器#11.89(+) 原点光纤传感器#11.90(L) 原点光纤传感器#12.89(+) 原点光纤传感器#12.90(L)
MLINK8-9: *#71.X44(MLINK_IN)
MLINK9-10: *#71.X44(MLINK_OUT) *#73.X44(MLINK_IN)
MO9_ENCODE: *#71.X44(ENCODE) *#72.29(ENCODE)
MO9_FG: *#71.X43(FG) *#72.29(FG)
MO9_U: *#71.X43(DC-) *#72.27(U)
MO9_V: *#71.X43(V) *#72.28(V)
MO9_W: *#71.X43(W) *#72.29(W)
MO10_ENCODE: *#73.X44(ENCODE) *#74.29(ENCODE)
MO10_FG: *#73.X43(FG) *#74.29(FG)
MO10_U: *#73.X43(DC-) *#74.27(U)
MO10_V: *#73.X43(V) *#74.28(V)
MO10_W: *#73.X43(W) *#74.29(W)
N401: *#71.X35(L2) *#71.X38(L2C) *#73.X35(L2) *#73.X38(L2C)

Not connected (* = marked no-connect by the designer): *#71 1(BREAK+)* 2(BREAK-)* 3(ALARM+)* 5(V+)* 10(EXT1) 11(EXT2)* 12(EXT3)* 13(NTL)* 14(BAT+)* 15(BAT-)* 16(SG(V-))* 17(A+)* 18(A-)* 19(B+)* 20(B-)* 21(Z+)* 22(Z-)* 23(RDY+)* 24(RDY-)* 25(WARN+)* 26(WARN-)* X36(L3)* X39(B1_+) X40(B2) X41(B3)* X42(DC-)*; *#72 30(BK)* 31(BK)*; *#73 1(BREAK+)* 2(BREAK-)* 3(ALARM+)* 5(V+)* 10(EXT1) 11(EXT2)* 12(EXT3)* 13(NTL)* 14(BAT+)* 15(BAT-)* 16(SG(V-))* 17(A+)* 18(A-)* 19(B+)* 20(B-)* 21(Z+)* 22(Z-)* 23(RDY+)* 24(RDY-)* 25(WARN+)* 26(WARN-)* X36(L3)* X39(B1_+)* X40(B2)* X41(B3)* X42(DC-)*; *#74 30(BK)* 31(BK)*

### Notes on the sheet
- (near *#71) 轴9
- (near *#71) SY
- 正限位开关
- 负限位开关
- 近原点开关
- 再生电阻
- (near *#73) 轴10
- (near *#73) SZ

### Library data of the parts
原点光纤传感器#7-原点光纤传感器#12 = OMRON_EE-SX671

## Sheet KV2_MotionA34.SchDoc
size A3; PageSetup: Record=PageOptions|CenterHorizontal=True|CenterVertical=True|PrintScale=1.00|XCorrection=1.00|YCorrection=1.00|PrintKind=2|BorderSize=5000000|LeftOffset=0|BottomOffset=0|Orientation=2|PaperLength=1000|PaperWidth=1000|Scale=100|PaperSource=7|PrintQuality=-4|MediaType=1|DitherType=10|PaperKind=A3|PrintScaleMode=1
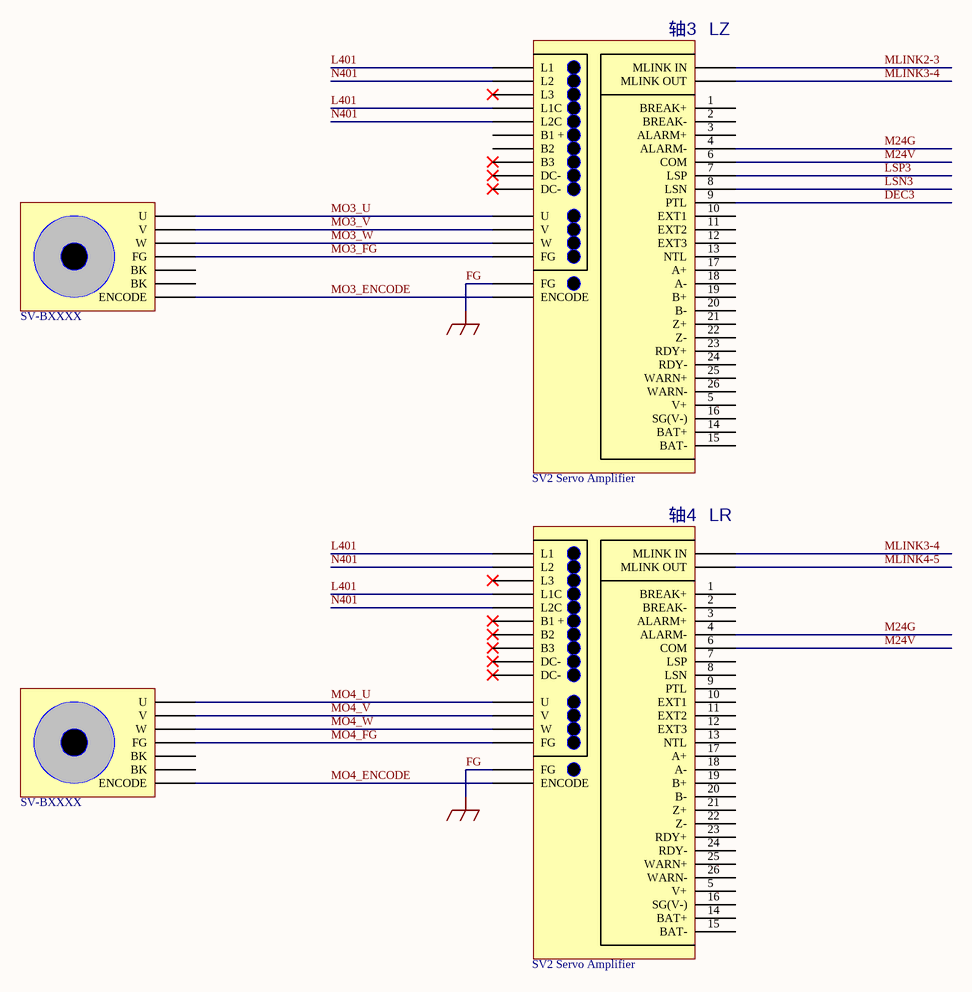
[diagram p6: KV2_MotionA34.SchDoc]

### Parts
(Parts that share a designator on the sheet are numbered #1, #2 ... from top to bottom, then left to right.)
*#75  SV2 Servo Amplifier
*#76  SV-BXXXX
*#77  SV2 Servo Amplifier
*#78  SV-BXXXX

### Nets
FG: *#75.X43(FG) *#77.X43(FG)  [also labelled GND]
DEC3: *#75.9(PTL)
L401: *#75.X34(L1) *#75.X37(L1C) *#77.X34(L1) *#77.X37(L1C)
LSN3: *#75.8(LSN)
LSP3: *#75.7(LSP)
M24G: *#75.4(ALARM-) *#77.4(ALARM-)
M24V: *#75.6(COM) *#77.6(COM)
MLINK2-3: *#75.X44(MLINK_IN)
MLINK3-4: *#75.X44(MLINK_OUT) *#77.X44(MLINK_IN)
MLINK4-5: *#77.X44(MLINK_OUT)
MO3_ENCODE: *#75.X44(ENCODE) *#76.29(ENCODE)
MO3_FG: *#75.X43(FG) *#76.29(FG)
MO3_U: *#75.X43(DC-) *#76.27(U)
MO3_V: *#75.X43(V) *#76.28(V)
MO3_W: *#75.X43(W) *#76.29(W)
MO4_ENCODE: *#77.X44(ENCODE) *#78.29(ENCODE)
MO4_FG: *#77.X43(FG) *#78.29(FG)
MO4_U: *#77.X43(DC-) *#78.27(U)
MO4_V: *#77.X43(V) *#78.28(V)
MO4_W: *#77.X43(W) *#78.29(W)
N401: *#75.X35(L2) *#75.X38(L2C) *#77.X35(L2) *#77.X38(L2C)

Not connected (* = marked no-connect by the designer): *#75 1(BREAK+) 2(BREAK-) 3(ALARM+) 5(V+) 10(EXT1) 11(EXT2) 12(EXT3) 13(NTL) 14(BAT+) 15(BAT-) 16(SG(V-)) 17(A+) 18(A-) 19(B+) 20(B-) 21(Z+) 22(Z-) 23(RDY+) 24(RDY-) 25(WARN+) 26(WARN-) X36(L3)* X39(B1_+) X40(B2) X41(B3)* X42(DC-)*; *#76 30(BK) 31(BK); *#77 1(BREAK+) 2(BREAK-) 3(ALARM+) 5(V+) 7(LSP) 8(LSN) 9(PTL) 10(EXT1) 11(EXT2) 12(EXT3) 13(NTL) 14(BAT+) 15(BAT-) 16(SG(V-)) 17(A+) 18(A-) 19(B+) 20(B-) 21(Z+) 22(Z-) 23(RDY+) 24(RDY-) 25(WARN+) 26(WARN-) X36(L3)* X39(B1_+)* X40(B2)* X41(B3)* X42(DC-)*; *#78 30(BK) 31(BK)

### Notes on the sheet
- (near *#75) 轴3
- (near *#75) LZ
- (near *#77) 轴4
- (near *#77) LR

## Sheet KV2_MotionA56.SchDoc
size A3; PageSetup: Record=PageOptions|CenterHorizontal=True|CenterVertical=True|PrintScale=1.00|XCorrection=1.00|YCorrection=1.00|PrintKind=2|BorderSize=5000000|LeftOffset=0|BottomOffset=0|Orientation=2|PaperLength=1000|PaperWidth=1000|Scale=100|PaperSource=7|PrintQuality=-4|MediaType=1|DitherType=10|PaperKind=A3|PrintScaleMode=1
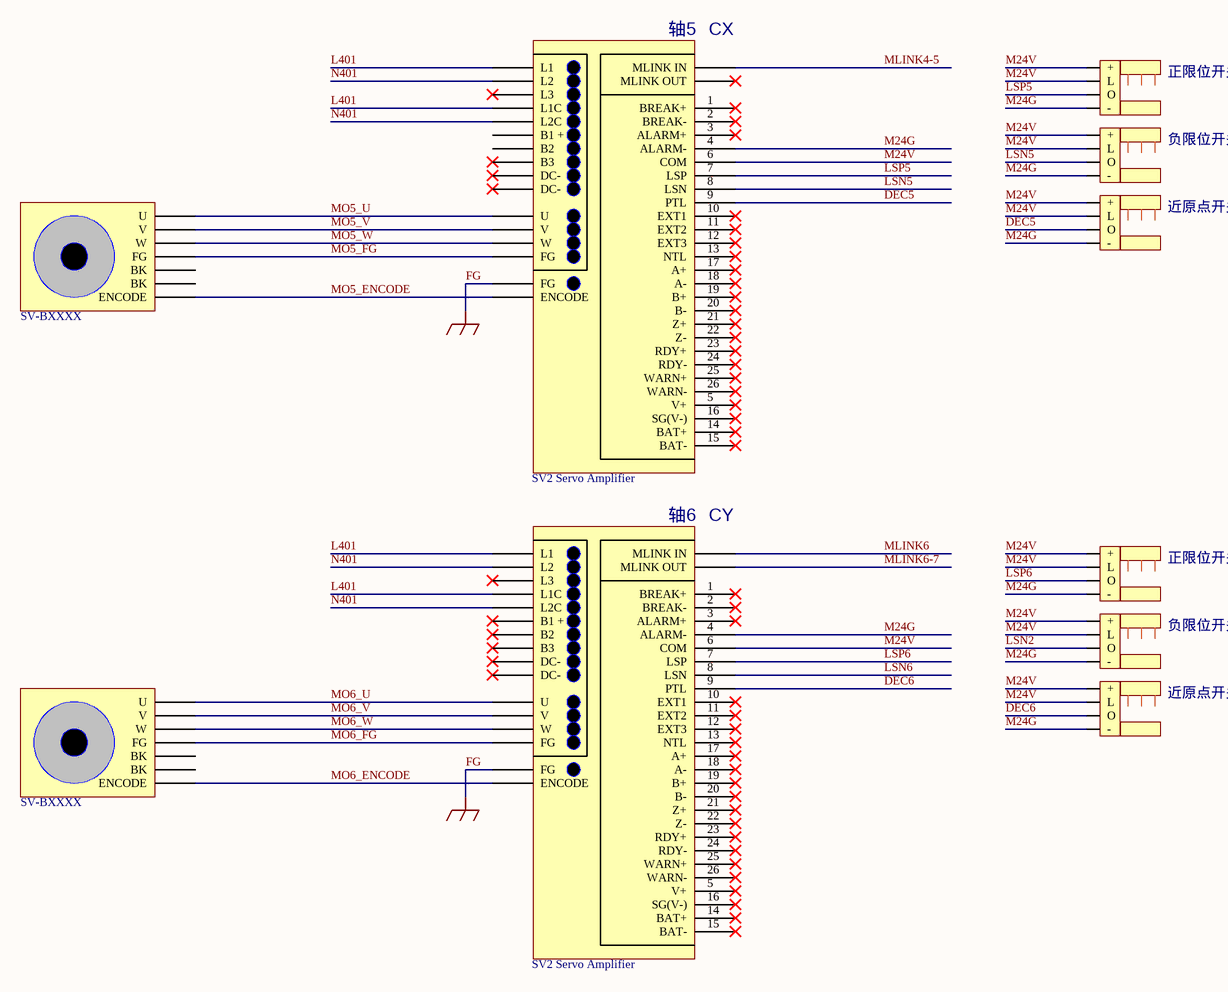
[diagram p7: KV2_MotionA56.SchDoc]

### Parts
(Parts that share a designator on the sheet are numbered #1, #2 ... from top to bottom, then left to right.)
*#79  SV2 Servo Amplifier
*#80  SV-BXXXX
*#81  SV2 Servo Amplifier
*#82  SV-BXXXX
原点光纤传感器#13  OMRON  E3X-HD  (value not drawn)
原点光纤传感器#14  OMRON  E3X-HD  (value not drawn)
原点光纤传感器#15  OMRON  E3X-HD  (value not drawn)
原点光纤传感器#16  OMRON  E3X-HD  (value not drawn)
原点光纤传感器#17  OMRON  E3X-HD  (value not drawn)
原点光纤传感器#18  OMRON  E3X-HD  (value not drawn)

### Nets
FG: *#79.X43(FG) *#81.X43(FG)  [also labelled GND]
DEC5: *#79.9(PTL) 原点光纤传感器#15.91(O)
DEC6: *#81.9(PTL) 原点光纤传感器#18.91(O)
L401: *#79.X34(L1) *#79.X37(L1C) *#81.X34(L1) *#81.X37(L1C)
LSN2: 原点光纤传感器#17.91(O)
LSN5: *#79.8(LSN) 原点光纤传感器#14.91(O)
LSN6: *#81.8(LSN)
LSP5: *#79.7(LSP) 原点光纤传感器#13.91(O)
LSP6: *#81.7(LSP) 原点光纤传感器#16.91(O)
M24G: *#79.4(ALARM-) *#81.4(ALARM-) 原点光纤传感器#13.92(-) 原点光纤传感器#14.92(-) 原点光纤传感器#15.92(-) 原点光纤传感器#16.92(-) 原点光纤传感器#17.92(-) 原点光纤传感器#18.92(-)
M24V: *#79.6(COM) *#81.6(COM) 原点光纤传感器#13.89(+) 原点光纤传感器#13.90(L) 原点光纤传感器#14.89(+) 原点光纤传感器#14.90(L) 原点光纤传感器#15.89(+) 原点光纤传感器#15.90(L) 原点光纤传感器#16.89(+) 原点光纤传感器#16.90(L) 原点光纤传感器#17.89(+) 原点光纤传感器#17.90(L) 原点光纤传感器#18.89(+) 原点光纤传感器#18.90(L)
MLINK4-5: *#79.X44(MLINK_IN)
MLINK6: *#81.X44(MLINK_IN)
MLINK6-7: *#81.X44(MLINK_OUT)
MO5_ENCODE: *#79.X44(ENCODE) *#80.29(ENCODE)
MO5_FG: *#79.X43(FG) *#80.29(FG)
MO5_U: *#79.X43(DC-) *#80.27(U)
MO5_V: *#79.X43(V) *#80.28(V)
MO5_W: *#79.X43(W) *#80.29(W)
MO6_ENCODE: *#81.X44(ENCODE) *#82.29(ENCODE)
MO6_FG: *#81.X43(FG) *#82.29(FG)
MO6_U: *#81.X43(DC-) *#82.27(U)
MO6_V: *#81.X43(V) *#82.28(V)
MO6_W: *#81.X43(W) *#82.29(W)
N401: *#79.X35(L2) *#79.X38(L2C) *#81.X35(L2) *#81.X38(L2C)

Not connected (* = marked no-connect by the designer): *#79 1(BREAK+)* 2(BREAK-)* 3(ALARM+)* 5(V+)* 10(EXT1)* 11(EXT2)* 12(EXT3)* 13(NTL)* 14(BAT+)* 15(BAT-)* 16(SG(V-))* 17(A+)* 18(A-)* 19(B+)* 20(B-)* 21(Z+)* 22(Z-)* 23(RDY+)* 24(RDY-)* 25(WARN+)* 26(WARN-)* X36(L3)* X39(B1_+) X40(B2) X41(B3)* X42(DC-)*; *#80 30(BK) 31(BK); *#81 1(BREAK+)* 2(BREAK-)* 3(ALARM+)* 5(V+)* 10(EXT1)* 11(EXT2)* 12(EXT3)* 13(NTL)* 14(BAT+)* 15(BAT-)* 16(SG(V-))* 17(A+)* 18(A-)* 19(B+)* 20(B-)* 21(Z+)* 22(Z-)* 23(RDY+)* 24(RDY-)* 25(WARN+)* 26(WARN-)* X36(L3)* X39(B1_+)* X40(B2)* X41(B3)* X42(DC-)*; *#82 30(BK) 31(BK)

### Notes on the sheet
- (near *#79) 轴5
- (near *#79) CX
- 正限位开关
- 负限位开关
- 近原点开关
- (near *#81) 轴6
- (near *#81) CY

### Library data of the parts
原点光纤传感器#13-原点光纤传感器#18 = OMRON_EE-SX671

## Sheet KV2_MotionA78.SchDoc
size A3; PageSetup: Record=PageOptions|CenterHorizontal=True|CenterVertical=True|PrintScale=1.00|XCorrection=1.00|YCorrection=1.00|PrintKind=2|BorderSize=5000000|LeftOffset=0|BottomOffset=0|Orientation=2|PaperLength=1000|PaperWidth=1000|Scale=100|PaperSource=7|PrintQuality=-4|MediaType=1|DitherType=10|PaperKind=A3|PrintScaleMode=1
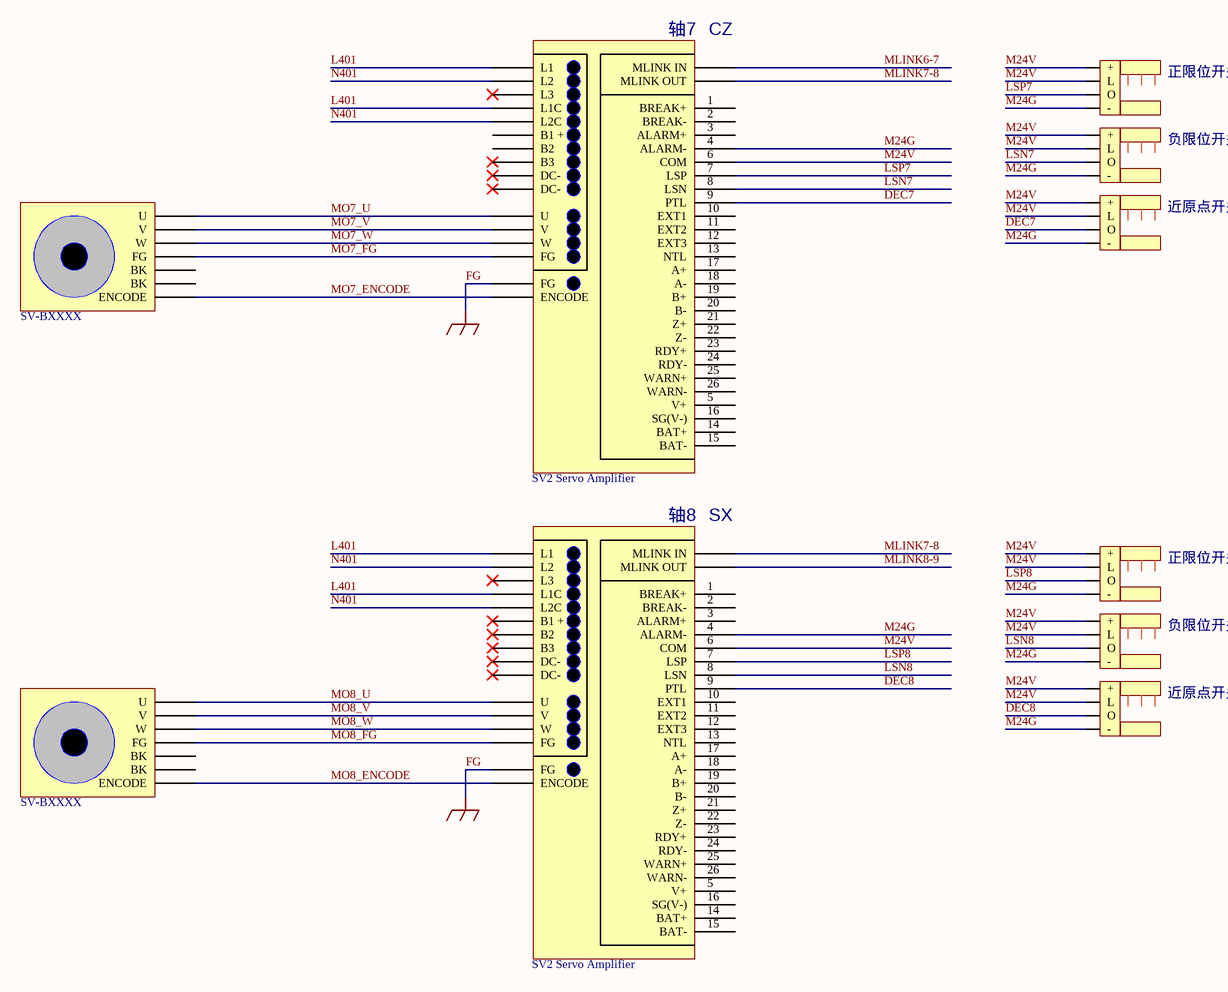
[diagram p8: KV2_MotionA78.SchDoc]

### Parts
(Parts that share a designator on the sheet are numbered #1, #2 ... from top to bottom, then left to right.)
*#83  SV2 Servo Amplifier
*#84  SV-BXXXX
*#85  SV2 Servo Amplifier
*#86  SV-BXXXX
原点光纤传感器#19  OMRON  E3X-HD  (value not drawn)
原点光纤传感器#20  OMRON  E3X-HD  (value not drawn)
原点光纤传感器#21  OMRON  E3X-HD  (value not drawn)
原点光纤传感器#22  OMRON  E3X-HD  (value not drawn)
原点光纤传感器#23  OMRON  E3X-HD  (value not drawn)
原点光纤传感器#24  OMRON  E3X-HD  (value not drawn)

### Nets
FG: *#83.X43(FG) *#85.X43(FG)  [also labelled GND]
DEC7: *#83.9(PTL) 原点光纤传感器#21.91(O)
DEC8: *#85.9(PTL) 原点光纤传感器#24.91(O)
L401: *#83.X34(L1) *#83.X37(L1C) *#85.X34(L1) *#85.X37(L1C)
LSN7: *#83.8(LSN) 原点光纤传感器#20.91(O)
LSN8: *#85.8(LSN) 原点光纤传感器#23.91(O)
LSP7: *#83.7(LSP) 原点光纤传感器#19.91(O)
LSP8: *#85.7(LSP) 原点光纤传感器#22.91(O)
M24G: *#83.4(ALARM-) *#85.4(ALARM-) 原点光纤传感器#19.92(-) 原点光纤传感器#20.92(-) 原点光纤传感器#21.92(-) 原点光纤传感器#22.92(-) 原点光纤传感器#23.92(-) 原点光纤传感器#24.92(-)
M24V: *#83.6(COM) *#85.6(COM) 原点光纤传感器#19.89(+) 原点光纤传感器#19.90(L) 原点光纤传感器#20.89(+) 原点光纤传感器#20.90(L) 原点光纤传感器#21.89(+) 原点光纤传感器#21.90(L) 原点光纤传感器#22.89(+) 原点光纤传感器#22.90(L) 原点光纤传感器#23.89(+) 原点光纤传感器#23.90(L) 原点光纤传感器#24.89(+) 原点光纤传感器#24.90(L)
MLINK6-7: *#83.X44(MLINK_IN)
MLINK7-8: *#83.X44(MLINK_OUT) *#85.X44(MLINK_IN)
MLINK8-9: *#85.X44(MLINK_OUT)
MO7_ENCODE: *#83.X44(ENCODE) *#84.29(ENCODE)
MO7_FG: *#83.X43(FG) *#84.29(FG)
MO7_U: *#83.X43(DC-) *#84.27(U)
MO7_V: *#83.X43(V) *#84.28(V)
MO7_W: *#83.X43(W) *#84.29(W)
MO8_ENCODE: *#85.X44(ENCODE) *#86.29(ENCODE)
MO8_FG: *#85.X43(FG) *#86.29(FG)
MO8_U: *#85.X43(DC-) *#86.27(U)
MO8_V: *#85.X43(V) *#86.28(V)
MO8_W: *#85.X43(W) *#86.29(W)
N401: *#83.X35(L2) *#83.X38(L2C) *#85.X35(L2) *#85.X38(L2C)

Not connected (* = marked no-connect by the designer): *#83 1(BREAK+) 2(BREAK-) 3(ALARM+) 5(V+) 10(EXT1) 11(EXT2) 12(EXT3) 13(NTL) 14(BAT+) 15(BAT-) 16(SG(V-)) 17(A+) 18(A-) 19(B+) 20(B-) 21(Z+) 22(Z-) 23(RDY+) 24(RDY-) 25(WARN+) 26(WARN-) X36(L3)* X39(B1_+) X40(B2) X41(B3)* X42(DC-)*; *#84 30(BK) 31(BK); *#85 1(BREAK+) 2(BREAK-) 3(ALARM+) 5(V+) 10(EXT1) 11(EXT2) 12(EXT3) 13(NTL) 14(BAT+) 15(BAT-) 16(SG(V-)) 17(A+) 18(A-) 19(B+) 20(B-) 21(Z+) 22(Z-) 23(RDY+) 24(RDY-) 25(WARN+) 26(WARN-) X36(L3)* X39(B1_+)* X40(B2)* X41(B3)* X42(DC-)*; *#86 30(BK) 31(BK)

### Notes on the sheet
- (near *#83) 轴7
- (near *#83) CZ
- 正限位开关
- 负限位开关
- 近原点开关
- (near *#85) 轴8
- (near *#85) SX

### Library data of the parts
原点光纤传感器#19-原点光纤传感器#24 = OMRON_EE-SX671

## Nets that join several sheets
FG: 电源分配_01 (22 pins), KV7500_PLC (*#47.196), KV2_MotionA12 (*#57.X43 *#59.X43), KV_Vision (*#64.8), KV2_MotionA9A (*#71.X43 *#73.X43), KV2_MotionA34 (*#75.X43 *#77.X43), KV2_MotionA56 (*#79.X43 *#81.X43), KV2_MotionA78 (*#83.X43 *#85.X43)
L48G: 电源分配_01 (*#46.2 *#46.3), KV7500_PLC (*#47.196), E150_Laser (*#69.1)
CX150FG: 电源分配_01 (*#44.2 *#44.3), KV_Vision (*#64.8)
CX150FV: 电源分配_01 (*#44.0 *#44.1), KV_Vision (*#64.7)
ETH1: 电源分配_01 (*#25.4), KV7500_PLC (*#48.201)
ETH3: 电源分配_01 (*#25.6), KV_Vision (*#64.?3)
KV_R52P1RD: KV7500_PLC (*#50.206), E150_Laser (*#70.6)
KV_R52P1SD: KV7500_PLC (*#50.205), E150_Laser (*#70.5)
KV_R52P1SG: KV7500_PLC (*#50.211), E150_Laser (*#70.7)
KV_R55000: 电源分配_01 (D?#1.1 KT2.7), KV7500_PLC (*#53.X18)
KV_R55001: 电源分配_01 (*#40.4), KV7500_PLC (*#53.X19)
KV_R55002: 电源分配_01 (*#43.4), KV7500_PLC (*#53.X20)
KV_R55003: 电源分配_01 (*#13.0), KV7500_PLC (*#53.X21)
KV_R55004: 电源分配_01 (*#13.0), KV7500_PLC (*#53.X22)
KV_R55005: 电源分配_01 (*#13.0), KV7500_PLC (*#53.X23)
KV_R55006: 电源分配_01 (*#13.0), KV7500_PLC (*#53.X24)
KV_R55007: 电源分配_01 (*#14.1), KV7500_PLC (*#53.X25)
KV_R55008: KV7500_PLC (*#53.X26), E150_Laser (*#70.12)
KV_R55009: KV7500_PLC (*#53.X27), E150_Laser (*#70.11)
KV_R55010: 电源分配_01 (*#7.2), KV7500_PLC (*#53.X28)
KV_R55011: 电源分配_01 (*#8.2), KV7500_PLC (*#53.X29)
KV_R55012: 电源分配_01 (*#9.2), KV7500_PLC (*#53.X30)
KV_R55013: 电源分配_01 (*#10.2), KV7500_PLC (*#53.X31)
KV_R58000: 电源分配_01 (*#40.3), KV7500_PLC (*#55.X0)
KV_R58001: 电源分配_01 (*#43.3), KV7500_PLC (*#55.X1)
KV_R58002: 电源分配_01 (S?#1.1), KV7500_PLC (*#55.X2)
KV_R58004: 电源分配_01 (*#14.3), KV7500_PLC (*#55.X4)
KV_R58005: 电源分配_01 (*#14.2), KV7500_PLC (*#55.X5)
KV_R58006: KV7500_PLC (*#55.X6), E150_Laser (*#70.10)
KV_R58007: KV7500_PLC (*#55.X7), E150_Laser (*#70.9)
KV_R58008: KV7500_PLC (*#55.X9), KV2_MotionA12 (P?#3.3)
KV_R58009: KV7500_PLC (*#55.X10), KV2_MotionA12 (P?#4.3)
KV_R58010: 电源分配_01 (P?#1.2), KV7500_PLC (*#55.X11)
KV_R58011: 电源分配_01 (P?#1.3), KV7500_PLC (*#55.X12)
KV_R59000: 电源分配_01 (*#25.2 *#30.1), KV7500_PLC (*#56.X0)
KV_R59001: 电源分配_01 (*#31.1), KV7500_PLC (*#56.X1)
KV_R59002: 电源分配_01 (*#32.1), KV7500_PLC (*#56.X2)
KV_R59003: 电源分配_01 (*#33.1), KV7500_PLC (*#56.X3)
KV_R59004: 电源分配_01 (*#34.1), KV7500_PLC (*#56.X4)
KV_R59005: 电源分配_01 (*#35.1), KV7500_PLC (*#56.X5)
KV_R59006: 电源分配_01 (*#36.1), KV7500_PLC (*#56.X6)
KV_R59007: 电源分配_01 (*#37.1), KV7500_PLC (*#56.X7)
KVGND: 电源分配_01 (*#25.0), KV7500_PLC (*#47.199)
L48V: 电源分配_01 (*#46.0 *#46.1), E150_Laser (*#69.0)
L400: 电源分配_01 (*#21.1 *#41.8 *#44.8), KV7500_PLC (*#47.194)
L401: 电源分配_01 (5 pins), KV2_MotionA12 (*#57.X34 *#57.X37 *#59.X34 *#59.X37), KV2_MotionA9A (*#71.X34 *#71.X37 *#73.X34 *#73.X37), KV2_MotionA34 (*#75.X34 *#75.X37 *#77.X34 *#77.X37), KV2_MotionA56 (*#79.X34 *#79.X37 *#81.X34 *#81.X37), KV2_MotionA78 (*#83.X34 *#83.X37 *#85.X34 *#85.X37)
LSN2: KV2_MotionA12 (*#59.8 原点光纤传感器#5.91), KV2_MotionA56 (原点光纤传感器#17.91)
M24G: 电源分配_01 (20 pins), KV7500_PLC (*#53.X8 *#53.X17 *#54.X8 *#54.X17), KV2_MotionA12 (12 pins), E150_Laser (*#70.1 *#70.8), KV2_MotionA9A (8 pins), KV2_MotionA34 (*#75.4 *#77.4), KV2_MotionA56 (8 pins), KV2_MotionA78 (8 pins)
M24V: 电源分配_01 (16 pins), KV7500_PLC (*#55.X8 *#55.X17 *#56.X8 *#56.X17), KV2_MotionA12 (14 pins), E150_Laser (*#70.2), KV2_MotionA9A (14 pins), KV2_MotionA34 (*#75.6 *#77.6), KV2_MotionA56 (14 pins), KV2_MotionA78 (14 pins)
MLINK1: KV7500_PLC (*#49.203), KV2_MotionA12 (*#57.X44)
MLINK2-3: KV2_MotionA12 (*#59.X44), KV2_MotionA34 (*#75.X44)
MLINK4-5: KV2_MotionA34 (*#77.X44), KV2_MotionA56 (*#79.X44)
MLINK6: KV7500_PLC (*#49.202), KV2_MotionA56 (*#81.X44)
MLINK6-7: KV2_MotionA56 (*#81.X44), KV2_MotionA78 (*#83.X44)
MLINK8-9: KV2_MotionA9A (*#71.X44), KV2_MotionA78 (*#85.X44)
N400: 电源分配_01 (*#21.0 *#41.7 *#44.7), KV7500_PLC (*#47.195)
N401: 电源分配_01 (5 pins), KV2_MotionA12 (*#57.X35 *#57.X38 *#59.X35 *#59.X38), KV2_MotionA9A (*#71.X35 *#71.X38 *#73.X35 *#73.X38), KV2_MotionA34 (*#75.X35 *#75.X38 *#77.X35 *#77.X38), KV2_MotionA56 (*#79.X35 *#79.X38 *#81.X35 *#81.X38), KV2_MotionA78 (*#83.X35 *#83.X38 *#85.X35 *#85.X38)
PAC0: 电源分配_01 (*#15.1), KV_Vision (*#61.1)